# Altium schematic sheet Page1.SchDoc
size 420 x 297 mm
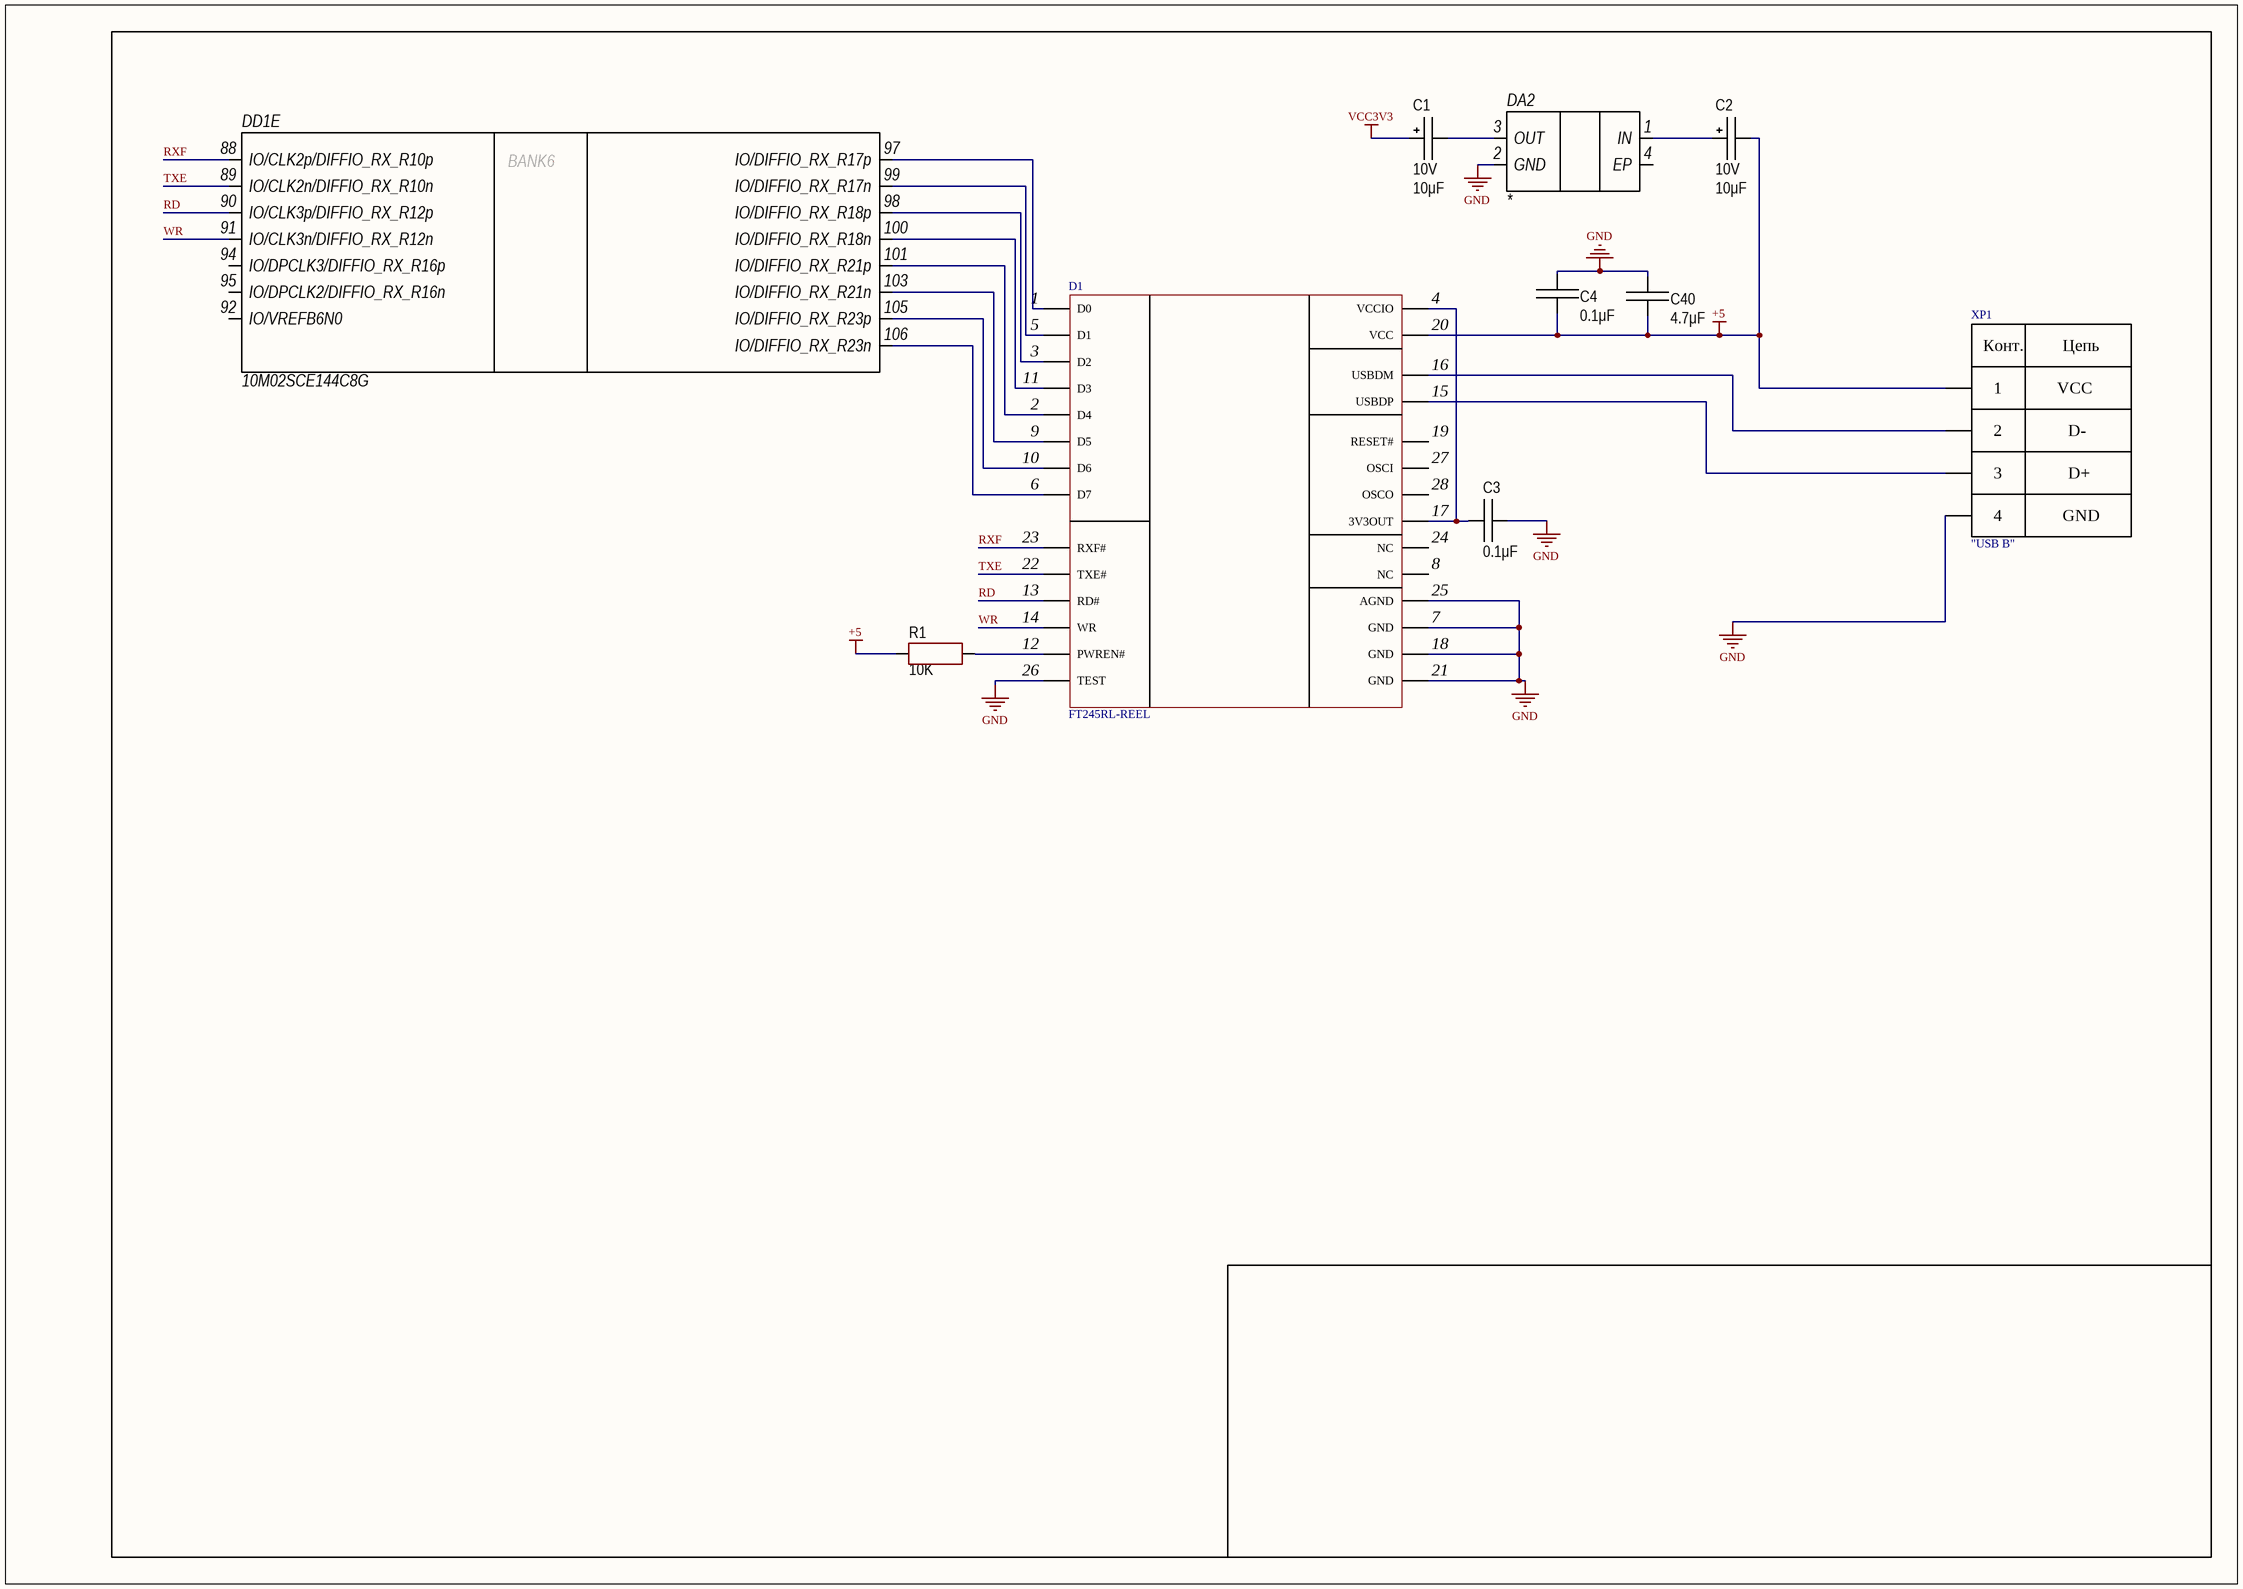
[diagram p0: Page1.SchDoc]

## Parts
C1  value 10μF  Voltage: 10V  [CAP: TANTAL-A]
C2  value 10μF  Voltage: 10V  [CAP: TANTAL-A]
C3  value 0.1μF  [CAP: 0805]
C4  value 0.1μF  [CAP: 0805]
C40  value 4.7μF  [CAP: 0805]
D1  FT245RL-REEL  [28-SSOP]
DA2  *  [SOT-223]
DD1  10M02SCE144C8G  [144-Lead EQFP]  (part E of 7)
R1  value 10K  [RES: 0805]
XP1  "USB B"  [USB B]

## Nets
+5: C2.2 C4.1 C40.1 D1.20(VCC) R1.1 XP1.1
GND: C3.2 C4.2 C40.2 D1.7(GND) D1.18(GND) D1.21(GND) D1.25(AGND) D1.26(TEST) DA2.2(GND) XP1.4
VCC3V3: C1.1
RD: D1.13(RD#) DD1.90(IO/CLK3p/DIFFIO_RX_R12p)
RXF: D1.23(RXF#) DD1.88(IO/CLK2p/DIFFIO_RX_R10p)
TXE: D1.22(TXE#) DD1.89(IO/CLK2n/DIFFIO_RX_R10n)
WR: D1.14(WR) DD1.91(IO/CLK3n/DIFFIO_RX_R12n)
NetC1_2: C1.2 DA2.3(OUT)
NetC2_1: C2.1 DA2.1(IN)
NetC3_1: C3.1 D1.4(VCCIO) D1.17(3V3OUT)
NetD1_1: D1.1(D0) DD1.97(IO/DIFFIO_RX_R17p)
NetD1_2: D1.2(D4) DD1.101(IO/DIFFIO_RX_R21p)
NetD1_3: D1.3(D2) DD1.98(IO/DIFFIO_RX_R18p)
NetD1_5: D1.5(D1) DD1.99(IO/DIFFIO_RX_R17n)
NetD1_6: D1.6(D7) DD1.106(IO/DIFFIO_RX_R23n)
NetD1_9: D1.9(D5) DD1.103(IO/DIFFIO_RX_R21n)
NetD1_10: D1.10(D6) DD1.105(IO/DIFFIO_RX_R23p)
NetD1_11: D1.11(D3) DD1.100(IO/DIFFIO_RX_R18n)
NetD1_12: D1.12(PWREN#) R1.2
NetD1_15: D1.15(USBDP) XP1.3
NetD1_16: D1.16(USBDM) XP1.2

Not connected (* = marked no-connect by the designer): D1 8(NC) 19(RESET#) 24(NC) 27(OSCI) 28(OSCO); DA2 4(EP); DD1 92(IO/VREFB6N0) 94(IO/DPCLK3/DIFFIO_RX_R16p) 95(IO/DPCLK2/DIFFIO_RX_R16n)

## Notes on the sheet
- (in symbol 10M02SCE144C8G, part E) BANK6
- (in symbol USB B) Конт.; Цепь; VCC; D-; D+; GND

## Library data of the parts
C1 C2 = Tantal_A: PartNumber: F930J107KAAAJ6; ValueManufacturerPartNumber: Tantalum capacitor, 10μF, 10V, ±10%, 2Ohm, case A (3216), -55...+85°C; Impedance: 2Ohm; Tolerance: ±10%; TypeDielectric: X7R; TypeCapacitor: Tantalum capacitor; Package: case A (3216); HelpURL: https://www.digikey.com/product-detail/en/avx-corporation/F930J107KAAAJ6/478-12404-1-ND/9645231; Temperature: -55...+85°C
C3 C4 C40 = Ceramic_0805: Manufacturer: Yageo; PartNumber: CC0805KRX7R7BB104; TypeCapacitor: Ceramic capacitor; Tolerance: ±10%; TypeDielectric: X7R; Package: 0805; HelpURL: https://www.digikey.com/product-detail/en/yageo/CC0805KRX7R7BB104/311-1142-1-ND/303052; ValueManufacturerPartNumber: =TypeCapacitor+', '+Value+', '+TypeDielectric+', '+Tolerance+', '+Voltage+', '+Package+', '+Temperature; Temperature: -55...+125°C
D1 = FT245RL-REEL: IC USB TO PARALLEL FIFO 28-SSOP; Manufature: FTDI, Future Technology Devices International Ltd; Model: FT245RL-REEL; HelpURL: https://www.digikey.com/product-detail/en/ftdi-future-technology-devices-international-ltd/FT245RL-REEL/768-1011-2-ND/1836389; Case: 28-SSOP
DA2 = MIC5233: Voltage Regulator; PartNumber: MIC5233-3.3YS; Value: *; Case: *
DD1 = 10M02SCE144C8G: MAX10 FPGA; Manufacturer: Intel; Value: 10M02SCE144C8G; HelpUrl: https://www.digikey.com/product-detail/en/intel/10M02SCE144C8G/544-3098-ND/5284822; PartNumber: 10M02SCE144C8G
R1 = Resistor_0805: Manufacturer: Yageo; PartNumber: RC0805JR-07100RL; TypeResistor: Resistor film; Power: 0.125W; Package: 0805; HelpURL: https://www.digikey.com/product-detail/en/yageo/RC0805JR-07100RL/311-100ARCT-ND/731185; ValueManufacturerPartNumber: =TypeResistor+', '+Value+', '+Tolerance+', '+Package+', '+Power+', '+Temperature; Temperature: -55...+125°C
XP1 = USB B: Type Connector: USB type B; Manufacture: *; Part Number: *; URL: *